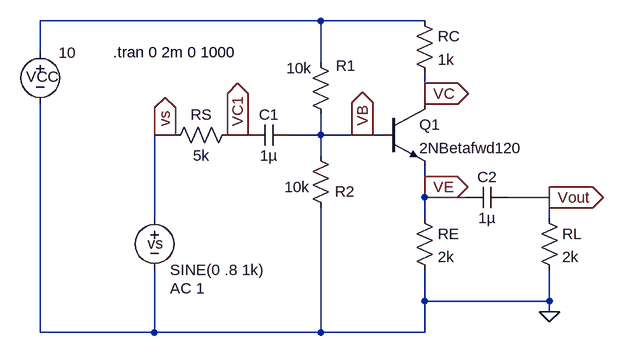
[diagram p0: schematic prob6_45_VCC10V_Beta120_transient.asc]
prob6_45_VCC10V_Beta120_transient.asc, the LTspice schematic file:
Version 4
SHEET 1 880 680
WIRE 96 0 -336 0
WIRE 256 0 96 0
WIRE -336 48 -336 0
WIRE 96 64 96 0
WIRE 256 112 256 80
WIRE 256 128 256 112
WIRE -144 176 -160 176
WIRE -128 176 -144 176
WIRE -32 176 -48 176
WIRE -16 176 -32 176
WIRE 96 176 96 144
WIRE 96 176 48 176
WIRE 160 176 96 176
WIRE 192 176 160 176
WIRE 96 208 96 176
WIRE 256 256 256 224
WIRE 256 272 256 256
WIRE 320 272 256 272
WIRE 448 272 384 272
WIRE -160 304 -160 176
WIRE 256 304 256 272
WIRE 448 304 448 272
WIRE 256 432 256 384
WIRE 448 432 448 384
WIRE 448 432 256 432
WIRE 448 448 448 432
WIRE -336 480 -336 128
WIRE -160 480 -160 384
WIRE -160 480 -336 480
WIRE 96 480 96 288
WIRE 96 480 -160 480
WIRE 256 480 256 432
WIRE 256 480 96 480
FLAG 448 448 0
FLAG 256 256 VE
IOPIN 256 256 Out
FLAG 448 272 Vout
IOPIN 448 272 Out
FLAG 160 176 VB
IOPIN 160 176 Out
FLAG 256 112 VC
IOPIN 256 112 Out
FLAG -144 176 vs
IOPIN -144 176 Out
FLAG -32 176 VC1
IOPIN -32 176 Out
SYMBOL res 80 48 R0
WINDOW 0 39 21 Left 2
WINDOW 3 -37 25 Left 2
SYMATTR InstName R1
SYMATTR Value 10k
SYMBOL res 80 192 R0
WINDOW 0 38 71 Left 2
WINDOW 3 -40 64 Left 2
SYMATTR InstName R2
SYMATTR Value 10k
SYMBOL res 240 288 R0
SYMATTR InstName RE
SYMATTR Value 2k
SYMBOL res 432 288 R0
SYMATTR InstName RL
SYMATTR Value 2k
SYMBOL res -32 160 R90
WINDOW 0 0 56 VBottom 2
WINDOW 3 32 56 VTop 2
SYMATTR InstName RS
SYMATTR Value 5k
SYMBOL cap 48 160 R90
WINDOW 0 0 32 VBottom 2
WINDOW 3 32 32 VTop 2
SYMATTR InstName C1
SYMATTR Value 1µ
SYMBOL cap 384 256 R90
WINDOW 0 0 32 VBottom 2
WINDOW 3 32 32 VTop 2
SYMATTR InstName C2
SYMATTR Value 1µ
SYMBOL voltage -160 288 R0
WINDOW 0 -11 55 Left 2
WINDOW 123 24 124 Left 2
WINDOW 39 0 0 Left 0
SYMATTR InstName vs
SYMATTR Value2 AC 1
SYMATTR Value SINE(0 .8 1k)
SYMBOL voltage -336 32 R0
WINDOW 0 -22 54 Left 2
WINDOW 3 28 17 Left 2
SYMATTR InstName VCC
SYMATTR Value 10
SYMBOL npn 192 128 R0
SYMATTR InstName Q1
SYMATTR Value 2NBetafwd120
SYMBOL res 240 -16 R0
SYMATTR InstName RC
SYMATTR Value 1k
TEXT -224 48 Left 2 !.tran 0 2m 0 1000

The netlist it stands for:
* prob6_45_VCC10V_Beta120_transient.asc
R1 N001 VB 10k
R2 VB 0 10k
RE VE 0 2k
RL Vout 0 2k
RS VC1 vs 5k
C1 VB VC1 1µ
C2 Vout VE 1µ
vs vs 0 SINE(0 .8 1k) AC 1
VCC N001 0 10
Q1 VC VB VE 0 2NBetafwd120
RC N001 VC 1k
.model NPN NPN
.model PNP PNP
.lib standard.bjt
.tran 0 2m 0 1000
.backanno
.end